# Altium schematic sheet BS01_and_BA01_Connectors.SchDoc
size A4; DocumentNumber: 3; SheetNumber: 3; SheetTotal: 7
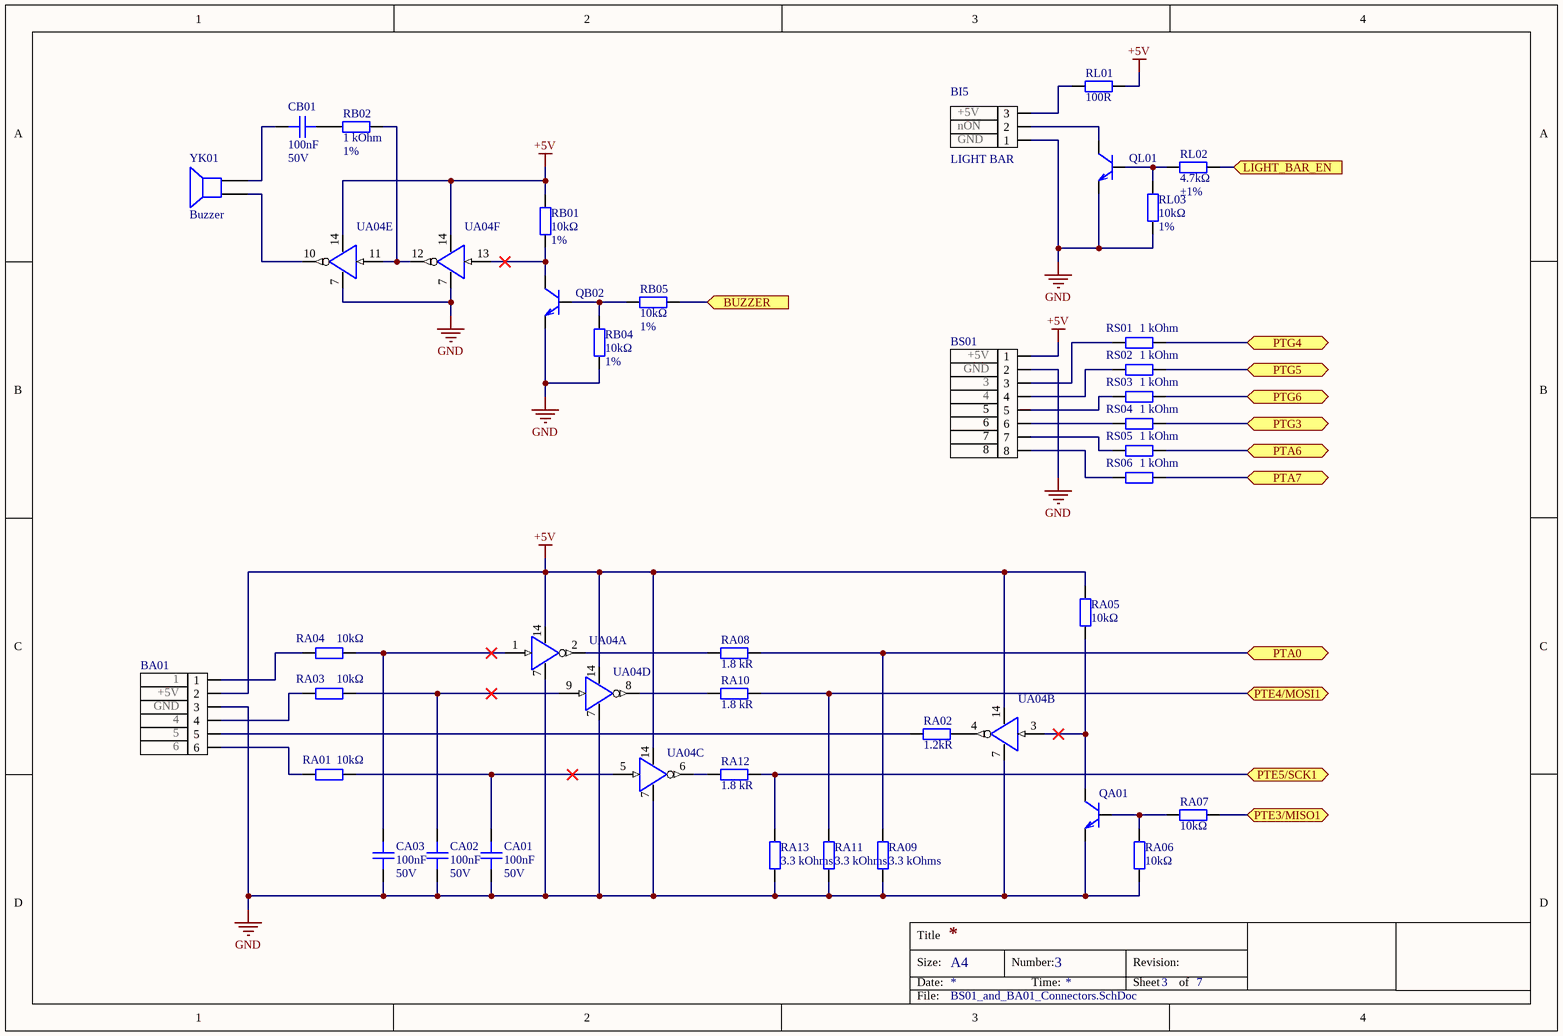
[diagram p0: BS01_and_BA01_Connectors.SchDoc]

## Parts
BA01  pin_1: 1  pin_2: +5V  pin_3: GND  pin_4: 4  pin_5: 5  pin_6: 6  (hidden comment: Comment)
BI5  LIGHT BAR  pin_1: GND  pin_2: nON  pin_3: +5V  [CONN_S3B-ZR_JST]
BS01  pin_1: +5V  pin_2: GND  pin_3: 3  pin_4: 4  pin_7: 7  pin_5: 5  pin_6: 6  pin_8: 8  [CONN HEADER R/A 8POS 2.54MM]  (hidden comment: CONN HEADER R/A 8POS 2.54MM)
CA01  Capacitance: 100nF  Voltage Rating: 50V  [CAPC1608X08N_0603]  (hidden comment: CAP CER 0.1uF ±10% 50V X7R 0603)
CA02  Capacitance: 100nF  Voltage Rating: 50V  [CAPC1608X08N_0603]  (hidden comment: CAP CER 0.1uF ±10% 50V X7R 0603)
CA03  Capacitance: 100nF  Voltage Rating: 50V  [CAPC1608X08N_0603]  (hidden comment: CAP CER 0.1uF ±10% 50V X7R 0603)
CB01  Capacitance: 100nF  Voltage Rating: 50V  [CAPC1608X08N_0603]  (hidden comment: CAP CER 0.1uF ±10% 50V X7R 0603)
QA01  BC847CW,115  [SOT-323]  (value not drawn)
QB02  BC847CW,115  [SOT-323]  (value not drawn)
QL01  BC847CW,115  [SOT-323]  (value not drawn)
RA01  Resistance: 10kΩ  [R0603]  (hidden comment: RES SMD 10K OHM 1% 1/10W 0603)
RA02  Resistance: 1.2kR  [R0402]  (hidden comment: RES SMD 1.2K OHM 1% 1/16W 0402)
RA03  Resistance: 10kΩ  [R0603]  (hidden comment: RES SMD 10K OHM 1% 1/10W 0603)
RA04  Resistance: 10kΩ  [R0603]  (hidden comment: RES SMD 10K OHM 1% 1/10W 0603)
RA05  Resistance: 10kΩ  [R0603]  (hidden comment: RES SMD 10K OHM 1% 1/10W 0603)
RA06  Resistance: 10kΩ  [R0603]  (hidden comment: RES SMD 10K OHM 1% 1/10W 0603)
RA07  Resistance: 10kΩ  [R0603]  (hidden comment: RES SMD 10K OHM 1% 1/10W 0603)
RA08  Resistance: 1.8 kR  [R0402]  (hidden comment: RES SMD 1.91K OHM 1% 1/16W 0402)
RA09  value 3.3 kOhms  [R_0603]  (hidden comment: RES SMD 3.3K OHM 1% 1/4W 0603)
RA10  Resistance: 1.8 kR  [R0402]  (hidden comment: RES SMD 1.91K OHM 1% 1/16W 0402)
RA11  value 3.3 kOhms  [R_0603]  (hidden comment: RES SMD 3.3K OHM 1% 1/4W 0603)
RA12  Resistance: 1.8 kR  [R0402]  (hidden comment: RES SMD 1.91K OHM 1% 1/16W 0402)
RA13  value 3.3 kOhms  [R_0603]  (hidden comment: RES SMD 3.3K OHM 1% 1/4W 0603)
RB01  Resistance: 10kΩ  Tolerance: 1%  [R0603]  (hidden comment: RES SMD 10K OHM 1% 1/10W 0603)
RB02  Resistance: 1 kOhm  Tolerance: 1%  [R0603]  (hidden comment: 1 kOhms ±1% 0.1W, 1/10W Chip Resistor 0603 (1608 Metric) Moisture Resistant Thick Film)  (no BOM)
RB04  Resistance: 10kΩ  Tolerance: 1%  [R0603]  (hidden comment: RES SMD 10K OHM 1% 1/10W 0603)
RB05  Resistance: 10kΩ  Tolerance: 1%  [R0603]  (hidden comment: RES SMD 10K OHM 1% 1/10W 0603)
RL01  Resistance: 100R  [R_0805]
RL02  Resistance: 4.7kΩ  Tolerance: ±1%  [Resistor-0603]
RL03  Resistance: 10kΩ  Tolerance: 1%  [R0603]  (hidden comment: RES SMD 10K OHM 1% 1/10W 0603)
RS01  Resistance: 1 kOhm  [R0603]  (hidden comment: 1 kOhms ±1% 0.1W, 1/10W Chip Resistor 0603 (1608 Metric) Moisture Resistant Thick Film)  (no BOM)
RS02  Resistance: 1 kOhm  [R0603]  (hidden comment: 1 kOhms ±1% 0.1W, 1/10W Chip Resistor 0603 (1608 Metric) Moisture Resistant Thick Film)  (no BOM)
RS03  Resistance: 1 kOhm  [R0603]  (hidden comment: 1 kOhms ±1% 0.1W, 1/10W Chip Resistor 0603 (1608 Metric) Moisture Resistant Thick Film)  (no BOM)
RS04  Resistance: 1 kOhm  [R0603]  (hidden comment: 1 kOhms ±1% 0.1W, 1/10W Chip Resistor 0603 (1608 Metric) Moisture Resistant Thick Film)  (no BOM)
RS05  Resistance: 1 kOhm  [R0603]  (hidden comment: 1 kOhms ±1% 0.1W, 1/10W Chip Resistor 0603 (1608 Metric) Moisture Resistant Thick Film)  (no BOM)
RS06  Resistance: 1 kOhm  [R0603]  (hidden comment: 1 kOhms ±1% 0.1W, 1/10W Chip Resistor 0603 (1608 Metric) Moisture Resistant Thick Film)  (no BOM)
UA04  IC SN74AC14D INVERT SCHMITT 6CH 6IN 14SOIC  (value not drawn)  (parts A,B,C,D,E,F of 6)
YK01  Buzzer  [PIN2]

## Ports
BUZZER (in), LIGHT_BAR_EN (in), PTA0 (bidir), PTA6 (bidir), PTA7 (bidir), PTE3/MISO1 (bidir), PTE4/MOSI1 (bidir), PTE5/SCK1 (bidir), PTG3 (bidir), PTG4 (bidir), PTG5 (bidir), PTG6 (bidir)

## Nets
+5V: BA01.2 BS01.1 RA05.1 RB01.2 RL01.1 UA04.14(VCC)
GND: BA01.3 BI5.1 BS01.2 CA01.1 CA02.1 CA03.1 QA01.2(E) QB02.2(E) QL01.2(E) RA06.2 RA09.2 RA11.2 RA13.2 RB04.1 RL03.1 UA04.7(GND)
BUZZER: RB05.1 ; port BUZZER
LIGHT_BAR_EN: RL02.2 ; port LIGHT_BAR_EN
PTA0: RA08.2 RA09.1 ; port PTA0
PTA6: RS05.2 ; port PTA6
PTA7: RS06.2 ; port PTA7
PTE3/MISO1: RA07.2 ; port PTE3/MISO1
PTE4/MOSI1: RA10.2 RA11.1 ; port PTE4/MOSI1
PTE5/SCK1: RA12.2 RA13.1 ; port PTE5/SCK1
PTG3: RS04.2 ; port PTG3
PTG4: RS01.2 ; port PTG4
PTG5: RS02.2 ; port PTG5
PTG6: RS03.2 ; port PTG6
NetBA01_1: BA01.1 RA04.2
NetBA01_4: BA01.4 RA03.2
NetBA01_5: BA01.5 RA02.1
NetBA01_6: BA01.6 RA01.2
NetBI5_2: BI5.2 QL01.3(C)
NetBI5_3: BI5.3 RL01.2
NetBS01_3: BS01.3 RS01.1
NetBS01_4: BS01.4 RS02.1
NetBS01_5: BS01.5 RS03.1
NetBS01_6: BS01.6 RS04.1
NetBS01_7: BS01.7 RS05.1
NetBS01_8: BS01.8 RS06.1
NetCA01_2: CA01.2 RA01.1 UA04.5(3A)
NetCA02_2: CA02.2 RA03.1 UA04.9(4A)
NetCA03_2: CA03.2 RA04.1 UA04.1(1A)
NetCB01_1: CB01.1 YK01.2
NetCB01_2: CB01.2 RB02.2
NetQA01_1: QA01.1(B) RA06.1 RA07.1
NetQA01_3: QA01.3(C) RA05.2 UA04.3(2A)
NetQB02_1: QB02.1(B) RB04.2 RB05.2
NetQB02_3: QB02.3(C) RB01.1 UA04.13(6A)
NetQL01_1: QL01.1(B) RL02.1 RL03.2
NetRA02_2: RA02.2 UA04.4(2Y)
NetRA08_1: RA08.1 UA04.2(1Y)
NetRA10_1: RA10.1 UA04.8(4Y)
NetRA12_1: RA12.1 UA04.6(3Y)
NetRB02_1: RB02.1 UA04.11(5A) UA04.12(6Y)
NetUA04_10: UA04.10(5Y) YK01.1

## Notes on the sheet
- Title
- Size:
- Date:
- A4
- Number:
- Time:
- Revision:
- Sheet
- of
- File:

## Library data of the parts
BA01 = CONN HEADER EC 6POS
BI5 = CONN HEADER TH R/A 3POS 1.5MM: Connector Header Through Hole, Right Angle 3 position 0.059" (1.50mm); Manufacturer: JST; Manufacturer Part Number: S3B-ZR(LF)(SN); Body Plating: Tin; Current Rating: 1A; Contact Resistance: 30mR; Voltage Rating: 50V; Number of Positions: 3; Gender: Male; Connector Type: Male Pin; Insulation Resistance: 500MR; Pitch: 1.5mm; Panel Thickness: 3.5mm; Supplier 1: Digi-Key; Stock 1: 0; Pricing 1: 1=0.2, 10=0.184, 100=0.1274, 500=0.1078, 1000=0.0882, 5000=0.0784, 10000=0.071 (USD); Mount: Through Hole; Number of Pins: 3; Contact Material: Brass,Copper,Tin; Color: Natural,White; Contact Plating: Tin,Copper; Housing Color: Beige; Housing Material: Polyamide; Material: Nylon; Min Operating Temperature: -25°C; Max Operating Temperature: 85°C; Number of Rows: 1; Packaging: Bulk; Max Current Rating: 1A; Termination: Press-Fit; Fastening Type: Detent; Number of Contacts: 3; Max Voltage Rating (AC): 50V; Orientation: Right Angle; Voltage Rating (AC): 50V; Voltage Rating (DC): 50V; Length: 6mm; Height: 7.2mm; Width: 3.5mm; Depth: 6mm; Lead Pitch: 1.5mm; Contact Mating Length: 0.094inch; Lead Free: Lead Free; REACH SVHC: No SVHC; Flammability Rating: UL94 V-0; ComponentLink1URL: http://www.jst-mfg.com/product/pdf/eng/eZH.pdf?src-supplier=Digi-Key; ComponentLink1Description: http://www.jst-mfg.com/product/pdf/eng/eZH.pdf?src-supplier=Digi-Key; ComponentLink2URL: https://www.verical.com/server-webapp/html/getDatasheet?partID=722697&src-supplier=Verical; ComponentLink2Description: https://www.verical.com/server-webapp/html/getDatasheet?partID=722697&src-supplier=Verical; ComponentLink3URL: http://www.produktinfo.conrad.com/datenblaetter/725000-749999/741155-da-01-en-STIFTLEISTE_GEWINKELT_3_POL_RM1_5.pdf?src-supplier=Conrad; ComponentLink3Description: http://www.produktinfo.conrad.com/datenblaetter/725000-749999/741155-da-01-en-STIFTLEISTE_GEWINKELT_3_POL_RM1_5.pdf?src-supplier=Conrad; Supplier Part Number 1: 455-1670-ND
BS01 = CONN HEADER R/A 8POS 2.54MM: Connector Header Through Hole, Right Angle 8 position 0.100" (2.54mm)
CA01 CA02 CA03 CB01 = CAP CER 0.1uF ±10% 50V X7R 0603: Capacitor; Manufacturer: KEMET; Manufacturer Part Number: C0603C104M5RACTU; Dielectric Material: Ceramic; Tolerance: 20%; Dissipation Factor: 2.5%; Supplier 1: Digi-Key; Stock 1: 1202175; Pricing 1: 1=0.1, 10=0.039, 50=0.0204, 100=0.0174, 500=0.0124, 1000=0.0097 (USD); Mount: Surface Mount,PCB; Case/Package: 0603; Case Code (Metric): 1608; Case Code (Imperial): 0603; Contact Plating: Tin,Matte; Min Operating Temperature: -55°C; Max Operating Temperature: 125°C; Package Quantity: 1; Packaging: Tape and Reel; Voltage Rating (DC): 50V; Dielectric: X7R; Termination: SMD/SMT; Length: 1.6mm; Height: 0.8mm; Width: 0.031inch; Thickness: 0.034inch; Lead Pitch: 0.7mm; Depth: 0.8mm; Radiation Hardening: No; REACH SVHC: No SVHC; ComponentLink1URL: http://www.farnell.com/datasheets/2746056.pdf?src-supplier=Element14; ComponentLink1Description: http://www.farnell.com/datasheets/2746056.pdf?src-supplier=Element14; ComponentLink2URL: http://www.mouser.com/ds/2/212/KEM_C1002_X7R_SMD-1102033.pdf?src-supplier=Mouser; ComponentLink2Description: http://www.mouser.com/ds/2/212/KEM_C1002_X7R_SMD-1102033.pdf?src-supplier=Mouser; ComponentLink3URL: https://www.verical.com/server-webapp/html/getDatasheet?partID=626892&src-supplier=Verical; ComponentLink3Description: https://www.verical.com/server-webapp/html/getDatasheet?partID=626892&src-supplier=Verical; ComponentLink4URL: http://components.arrow.com/part/dataview/40911037S8853915N7429?src-supplier=Arrow; ComponentLink4Description: http://components.arrow.com/part/dataview/40911037S8853915N7429?src-supplier=Arrow; ComponentLink5URL: http://capacitoredge.kemet.com/capedge2/DataSheet?pn=C0603C104M5RAC7867&src-supplier=Avnet; ComponentLink5Description: http://capacitoredge.kemet.com/capedge2/DataSheet?pn=C0603C104M5RAC7867&src-supplier=Avnet; ComponentLink6URL: http://capacitoredge.kemet.com/capedge2/DataSheet?pn=C0603C104M5RAC7867&src-supplier=Avnet+Asia; ComponentLink6Description: http://capacitoredge.kemet.com/capedge2/DataSheet?pn=C0603C104M5RAC7867&src-supplier=Avnet+Asia; ComponentLink7URL: http://www.farnell.com/datasheets/2746056.pdf?src-supplier=Farnell; ComponentLink7Description: http://www.farnell.com/datasheets/2746056.pdf?src-supplier=Farnell; ComponentLink8URL: http://www.farnell.com/datasheets/2746056.pdf?src-supplier=Newark; ComponentLink8Description: http://www.farnell.com/datasheets/2746056.pdf?src-supplier=Newark; ComponentLink9URL: http://www.alliedelec.com/m/d/6f3b5eb83d09db50ed28bdc730567b33.pdf?src-supplier=Allied+Electronics; ComponentLink9Description: http://www.alliedelec.com/m/d/6f3b5eb83d09db50ed28bdc730567b33.pdf?src-supplier=Allied+Electronics; ComponentLink10URL: https://api.kemet.com/component-edge/download/datasheet/C0603C104M5RACTU.pdf?src-supplier=Digi-Key; ComponentLink10Description: https://api.kemet.com/component-edge/download/datasheet/C0603C104M5RACTU.pdf?src-supplier=Digi-Key; ComponentLink11URL: http://www.farnell.com/datasheets/2315113.pdf?src-supplier=Newark; ComponentLink11Description: http://www.farnell.com/datasheets/2315113.pdf?src-supplier=Newark; ComponentLink12URL: http://www.farnell.com/datasheets/1828800.pdf?src-supplier=Newark; ComponentLink12Description: http://www.farnell.com/datasheets/1828800.pdf?src-supplier=Newark; ComponentLink13URL: http://components.arrow.com/part/dataview/0323_00313986?src-supplier=Arrow+Europe; ComponentLink13Description: http://components.arrow.com/part/dataview/0323_00313986?src-supplier=Arrow+Europe; ComponentLink14URL: https://www.verical.com/server-webapp/html/getDatasheet?partID=110138&src-supplier=Verical; ComponentLink14Description: https://www.verical.com/server-webapp/html/getDatasheet?partID=110138&src-supplier=Verical; Supplier Part Number 1: 399-7845-1-ND
QA01 QB02 QL01 = TRANS BC847CW,115 NPN 45V 0.1A SOT323: Bipolar (BJT) Transistor NPN 45V 100mA 100MHz 200mW Surface Mount SOT-323-3; Manufacturer: Nexperia; Supplier 1: Digi-Key; Manufacturer Part Number: BC847CW,115; Stock 1: 327256; Pricing 1: 1=0.13, 10=0.118, 25=0.1124, 100=0.0495, 250=0.0475, 500=0.0389, 1000=0.027 (USD); ComponentLink1URL: http://www.farnell.com/datasheets/1856333.pdf?src-supplier=Farnell; ComponentLink1Description: http://www.farnell.com/datasheets/1856333.pdf?src-supplier=Farnell; ComponentLink2URL: http://www.farnell.com/datasheets/1856333.pdf?src-supplier=Element14; ComponentLink2Description: http://www.farnell.com/datasheets/1856333.pdf?src-supplier=Element14; ComponentLink3URL: https://assets.nexperia.com/documents/data-sheet/BC847_SER.pdf?src-supplier=Digi-Key; ComponentLink3Description: https://assets.nexperia.com/documents/data-sheet/BC847_SER.pdf?src-supplier=Digi-Key; ComponentLink4URL: http://www.farnell.com/datasheets/1856333.pdf?src-supplier=Newark; ComponentLink4Description: http://www.farnell.com/datasheets/1856333.pdf?src-supplier=Newark; Supplier Part Number 1: 1727-4312-1-ND
RA01 RA03 RA04 RA05 RA06 RA07 RB01 RB04 RB05 RL03 = RES SMD 10K OHM 1% 1/10W 0603: 10 kOhms ±1% 0.1W, 1/10W Chip Resistor 0603 (1608 Metric)  Thick Film; Manufacturer: Yageo; Manufacturer Part Number: RC0603FR-0710KL; Temperature Coefficient: 100ppm/°C; Voltage Rating: 75V; Power Rating: 100mW; Voltage Rating (DC): 50V; Supplier 1: Digi-Key; Stock 1: 81498627; Pricing 1: 1=0.1, 10=0.024, 100=0.0097, 1000=0.0044, 2500=0.0038 (USD); Case/Package: 0603; Number of Pins: 2; Weight: 7.1E-05oz; Case Code (Imperial): 0603; Case Code (Metric): 1608; Min Operating Temperature: -55°C; Max Operating Temperature: 155°C; Packaging: Tape and Reel; Composition: Thick Film; Military Standard: Not; Termination: SMD/SMT; Length: 1.6mm; Height: 0.45mm; Width: 0.8mm; Depth: 0.8mm; Lead Pitch: 0.3mm; Lead Free: Lead Free; REACH SVHC: No SVHC; ComponentLink1URL: http://www.farnell.com/datasheets/38590.pdf?src-supplier=Element14; ComponentLink1Description: http://www.farnell.com/datasheets/38590.pdf?src-supplier=Element14; ComponentLink2URL: https://www.verical.com/server-webapp/html/getDatasheet?partID=409289&src-supplier=Verical; ComponentLink2Description: https://www.verical.com/server-webapp/html/getDatasheet?partID=409289&src-supplier=Verical; ComponentLink3URL: http://www.farnell.com/datasheets/1868787.pdf?src-supplier=Element14; ComponentLink3Description: http://www.farnell.com/datasheets/1868787.pdf?src-supplier=Element14; ComponentLink4URL: http://www.farnell.com/datasheets/2167052.pdf?src-supplier=Element14; ComponentLink4Description: http://www.farnell.com/datasheets/2167052.pdf?src-supplier=Element14; ComponentLink5URL: http://www.farnell.com/datasheets/443971.pdf?src-supplier=Element14; ComponentLink5Description: http://www.farnell.com/datasheets/443971.pdf?src-supplier=Element14; Supplier Part Number 1: 311-10.0KHRCT-ND
  RA01 RA03 RA04 RA05 RA06 RA07: Tolerance: 1%
RA02 = RES SMD 1.2K OHM 1% 1/16W 0402: 1.2 kOhms ±1% 0.063W, 1/16W Chip Resistor 0402 (1005 Metric) Moisture Resistant Thick Film; Manufacturer: Yageo; Manufacturer Part Number: RC0402FR-071K2L; Power Rating: 63mW; Voltage Rating: 50V; Temperature Coefficient: 100ppm/°C; Supplier 1: Digi-Key; Stock 1: 894472; Pricing 1: 1=0.1, 10=0.015, 100=0.0062, 1000=0.0028, 2500=0.0024, 5000=0.002 (USD); Case/Package: 0402; Case Code (Imperial): 0402; Case Code (Metric): 1005; Min Operating Temperature: -55°C; Max Operating Temperature: 155°C; Packaging: Tape and Reel; Package Quantity: 1; Termination: SMD/SMT; Composition: Thick Film; Number of Terminations: 2; Military Standard: Not; Max Power Dissipation: 63mW; Features: Moisture Resistant; Length: 1mm; Height: 0.016inch; Width: 0.02inch; Depth: 0.5mm; REACH SVHC: Unknown; Lead Free: Lead Free; ComponentLink1URL: http://www.farnell.com/datasheets/2167052.pdf?src-supplier=Element14; ComponentLink1Description: http://www.farnell.com/datasheets/2167052.pdf?src-supplier=Element14; ComponentLink2URL: https://www.verical.com/server-webapp/html/getDatasheet?partID=323716&src-supplier=Verical; ComponentLink2Description: https://www.verical.com/server-webapp/html/getDatasheet?partID=323716&src-supplier=Verical; ComponentLink3URL: http://documents.rs-components.com/techlib://itc_doclist_GB.htm?stockno=6186138&src-supplier=RSComponents; ComponentLink3Description: http://documents.rs-components.com/techlib://itc_doclist_GB.htm?stockno=6186138&src-supplier=RSComponents; ComponentLink4URL: http://www.yageo.com/documents/recent/PYu-RC_Group_51_RoHS_L_10.pdf?src-supplier=Digi-Key; ComponentLink4Description: http://www.yageo.com/documents/recent/PYu-RC_Group_51_RoHS_L_10.pdf?src-supplier=Digi-Key; ComponentLink5URL: http://www.yageo.com/documents/recent/PYu-RC_Group_51_RoHS_L_9.pdf?src-supplier=Digi-Key; ComponentLink5Description: http://www.yageo.com/documents/recent/PYu-RC_Group_51_RoHS_L_9.pdf?src-supplier=Digi-Key; ComponentLink6URL: http://www.yageo.com/documents/recent/PYu-RC0402_51_RoHS_L_6_r.pdf?src-supplier=Future+Electronics; ComponentLink6Description: http://www.yageo.com/documents/recent/PYu-RC0402_51_RoHS_L_6_r.pdf?src-supplier=Future+Electronics; Supplier Part Number 1: 311-1.20KLRCT-ND; Tolerance: 1%
RA08 RA10 RA12 = RES SMD 1.91K OHM 1% 1/16W 0402: 1.91 kOhms ±1% 0.063W, 1/16W Chip Resistor 0402 (1005 Metric) Moisture Resistant Thick Film; Manufacturer: Yageo; Manufacturer Part Number: RC0402FR-071K91L; Power Rating: 62.5mW; Voltage Rating: 50V; Temperature Coefficient: 100ppm/°C; Max Power Dissipation: 63mW; Supplier 1: Digi-Key; Stock 1: 7277; Pricing 1: 1=0.1, 10=0.015, 100=0.0062, 1000=0.0028, 2500=0.0024, 5000=0.002 (USD); Case/Package: 0402; Case Code (Imperial): 0402; Case Code (Metric): 1005; Contact Plating: Tin,Matte; Min Operating Temperature: -55°C; Max Operating Temperature: 155°C; Packaging: Tape and Reel; Composition: Thick Film; Number of Terminations: 2; Termination: SMD/SMT; Military Standard: Not; Voltage Rating (DC): 50V; Features: Moisture Resistant; Length: 1mm; Height: 0.016inch; Width: 0.02inch; Depth: 0.5mm; Lead Free: Lead Free; ComponentLink1URL: http://www.yageo.com/documents/recent/PYu-RC0402_51_RoHS_L_6.pdf?src-supplier=Avnet+Europe; ComponentLink1Description: http://www.yageo.com/documents/recent/PYu-RC0402_51_RoHS_L_6.pdf?src-supplier=Avnet+Europe; ComponentLink2URL: http://www.yageo.com/documents/recent/PYu-RC0402_51_RoHS_L_6.pdf?src-supplier=Avnet; ComponentLink2Description: http://www.yageo.com/documents/recent/PYu-RC0402_51_RoHS_L_6.pdf?src-supplier=Avnet; Supplier Part Number 1: YAG3049CT-ND; Tolerance: 1%
RA09 RA11 RA13 = RES_SMD_3.3K_OHM_1%_1/4W_0603: PartNumber: CRCW06033K30FKEAHP; Manufacturer: Vishay Dale; Link: https://www.digikey.com/product-detail/en/vishay-dale/CRCW06033K30FKEAHP/541-3.30KSCT-ND/2826016; Digi-KeyPartNumber: 541-3.30KSCT-ND
RB02 = RES SMD 1K OHM 1% 1/10W 0603: Manufacturer: Yageo; Manufacturer Part Number: RC0603FR-071KL; Temperature Coefficient: 100ppm/°C; Voltage Rating: 50V; Power Rating: 100mW; Supplier 1: Digi-Key; Stock 1: 39344753; Pricing 1: 1=0.1, 10=0.023, 100=0.0094, 1000=0.0042, 2500=0.0037 (USD); Case/Package: 0603; Case Code (Imperial): 0603; Case Code (Metric): 1608; Min Operating Temperature: -55°C; Max Operating Temperature: 155°C; Packaging: Tape and Reel; Composition: Thick Film; Military Standard: Not; Termination: SMD/SMT; Length: 1.6mm; Height: 0.45mm; Depth: 0.8mm; Lead Free: Lead Free; REACH SVHC: No SVHC; ComponentLink1URL: http://documents.rs-components.com/techlib://itc_doclist_GB.htm?stockno=5048928&src-supplier=RSComponents; ComponentLink1Description: http://documents.rs-components.com/techlib://itc_doclist_GB.htm?stockno=5048928&src-supplier=RSComponents; ComponentLink2URL: http://www.yageo.com/documents/recent/PYu-RC0603_51_RoHS_L_4.pdf?src-supplier=Avnet+Europe; ComponentLink2Description: http://www.yageo.com/documents/recent/PYu-RC0603_51_RoHS_L_4.pdf?src-supplier=Avnet+Europe; ComponentLink3URL: http://www.farnell.com/datasheets/2167052.pdf?src-supplier=Element14; ComponentLink3Description: http://www.farnell.com/datasheets/2167052.pdf?src-supplier=Element14; ComponentLink4URL: http://www.farnell.com/datasheets/1868787.pdf?src-supplier=Element14; ComponentLink4Description: http://www.farnell.com/datasheets/1868787.pdf?src-supplier=Element14; ComponentLink5URL: http://www.yageo.com/documents/recent/PYu-RC_Group_51_RoHS_L_2.pdf?src-supplier=Avnet; ComponentLink5Description: http://www.yageo.com/documents/recent/PYu-RC_Group_51_RoHS_L_2.pdf?src-supplier=Avnet; Supplier Part Number 1: 311-1.00KHRDKR-ND; Contact Plating: Tin,Matte; Radiation Hardening: No; ComponentLink6URL: https://www.verical.com/server-webapp/html/getDatasheet?partID=404327&src-supplier=Verical; ComponentLink6Description: https://www.verical.com/server-webapp/html/getDatasheet?partID=404327&src-supplier=Verical; ComponentLink7URL: http://www.farnell.com/datasheets/443971.pdf?src-supplier=Element14; ComponentLink7Description: http://www.farnell.com/datasheets/443971.pdf?src-supplier=Element14
RL01 = RES SMD 100 OHM 1% 1/2W 0805: 100 Ohms ±1% 0.5W, 1/2W Chip Resistor 0805 (2012 Metric) Automotive AEC-Q200, Pulse Withstanding Thick Film; Manufacturer: Panasonic; Manufacturer Part Number: ERJ-P6WF1000V; Temperature Coefficient: 200ppm/°C; Power Rating: 500mW; Voltage Rating: 150V; Supplier 1: Digi-Key; Stock 1: 36332; Pricing 1: 1=0.54, 10=0.412, 100=0.1731, 1000=0.0955, 2500=0.0896 (USD); Case/Package: 0805; Case Code (Imperial): 0805; Case Code (Metric): 2012; Min Operating Temperature: -55°C; Max Operating Temperature: 155°C; Packaging: Cut Tape; Composition: Thick Film; Termination: Flat; Number of Terminations: 2; Max Power Dissipation: 500mW; Features: Automotive AEC-Q200; Length: 0.079inch; Height: 0.03inch; Width: 0.049inch; Depth: 1.25mm; Supplier Part Number 1: P16873CT-ND; Tolerance: 1%; Contact Plating: Tin; Voltage Rating (DC): 150V; REACH SVHC: No SVHC; ComponentLink1URL: http://industrial.panasonic.com/www-data/pdf/AOA0000/AOA0000CE4.pdf?src-supplier=Avnet; ComponentLink1Description: http://industrial.panasonic.com/www-data/pdf/AOA0000/AOA0000CE4.pdf?src-supplier=Avnet; ComponentLink2URL: http://www.farnell.com/datasheets/1790600.pdf?src-supplier=Element14; ComponentLink2Description: http://www.farnell.com/datasheets/1790600.pdf?src-supplier=Element14; ComponentLink3URL: https://www.distrelec.biz/Web/Downloads/_t/ds/ERJP-series_eng_tds.pdf?mime=application%2Fpdf&src-supplier=Distrelec; ComponentLink3Description: https://www.distrelec.biz/Web/Downloads/_t/ds/ERJP-series_eng_tds.pdf?mime=application%2Fpdf&src-supplier=Distrelec
RL02 = R 4.7kΩ ±1% 0603 0.1W: Resistor; Manufacturer: Yageo; Manufacturer Part Number: AC0603FR-074K7L; Temperature Coefficient: 100ppm/°C; Power Rating: 100mW; Voltage Rating: 50V; Supplier 1: Digi-Key; Stock 1: 568000; Pricing 1: 1=0.1, 10=0.029, 100=0.0118, 1000=0.0053, 2500=0.0046 (USD); Case/Package: 0603; Case Code (Imperial): 0603; Case Code (Metric): 1608; Min Operating Temperature: -55°C; Max Operating Temperature: 155°C; Packaging: Tape and Reel; Composition: Thick Film; Military Standard: Not; Termination: SMD/SMT; Number of Terminations: 2; Max Power Dissipation: 100mW; Features: Moisture Resistant,Automotive AEC-Q200; Length: 0.063inch; Height: 0.022inch; Width: 0.031inch; Depth: 0.8mm; Lead Free: Lead Free; Supplier Part Number 1: YAG3613CT-ND
RS01 RS02 RS03 RS04 RS05 RS06 = RES SMD 1K OHM 1% 1/10W 0603: Manufacturer: Yageo; Manufacturer Part Number: RC0603FR-071KL; Temperature Coefficient: 100ppm/°C; Power Rating: 100mW; Voltage Rating: 50V; Supplier 1: Digi-Key; Stock 1: 39344753; Pricing 1: 1=0.1, 10=0.023, 100=0.0094, 1000=0.0042, 2500=0.0037 (USD); Contact Plating: Tin,Matte; Case Code (Imperial): 0603; Case Code (Metric): 1608; Min Operating Temperature: -55°C; Max Operating Temperature: 155°C; Composition: Thick Film; Packaging: Tape and Reel; Termination: SMD/SMT; Military Standard: Not; Length: 1.6mm; Height: 0.45mm; Depth: 0.8mm; Radiation Hardening: No; REACH SVHC: No SVHC; Lead Free: Lead Free; ComponentLink1URL: http://documents.rs-components.com/techlib://itc_doclist_GB.htm?stockno=5048928&src-supplier=RSComponents; ComponentLink1Description: http://documents.rs-components.com/techlib://itc_doclist_GB.htm?stockno=5048928&src-supplier=RSComponents; ComponentLink2URL: http://www.yageo.com/documents/recent/PYu-RC0603_51_RoHS_L_4.pdf?src-supplier=Avnet+Europe; ComponentLink2Description: http://www.yageo.com/documents/recent/PYu-RC0603_51_RoHS_L_4.pdf?src-supplier=Avnet+Europe; ComponentLink3URL: http://www.farnell.com/datasheets/2167052.pdf?src-supplier=Element14; ComponentLink3Description: http://www.farnell.com/datasheets/2167052.pdf?src-supplier=Element14; ComponentLink4URL: http://www.farnell.com/datasheets/1868787.pdf?src-supplier=Element14; ComponentLink4Description: http://www.farnell.com/datasheets/1868787.pdf?src-supplier=Element14; ComponentLink5URL: http://www.yageo.com/documents/recent/PYu-RC_Group_51_RoHS_L_2.pdf?src-supplier=Avnet; ComponentLink5Description: http://www.yageo.com/documents/recent/PYu-RC_Group_51_RoHS_L_2.pdf?src-supplier=Avnet; ComponentLink6URL: https://www.verical.com/server-webapp/html/getDatasheet?partID=404327&src-supplier=Verical; ComponentLink6Description: https://www.verical.com/server-webapp/html/getDatasheet?partID=404327&src-supplier=Verical; ComponentLink7URL: http://www.farnell.com/datasheets/443971.pdf?src-supplier=Element14; ComponentLink7Description: http://www.farnell.com/datasheets/443971.pdf?src-supplier=Element14; Supplier Part Number 1: 311-1.00KHRDKR-ND; Case/Package: 0603; Tolerance: 1%
UA04 = IC SN74AC14D INVERT SCHMITT 6CH 6IN 14SOIC: Inverter IC 6 Channel Schmitt Trigger 14-SOIC; Manufacturer: ON Semiconductor / Fairchild; Manufacturer Part Number: 74AC14SCX; Logic Function: Buffer,Inverter,Schmitt Trigger; Number of Elements: 6; Propagation Delay: 15ns; Max Supply Voltage: 6V; Min Supply Voltage: 2V; Number of Inputs: 1; Quiescent Current: 2uA; High Level Output Current: -24mA; Low Level Output Current: 24mA; Schmitt Trigger Input: Yes; Voltage: 5V; Supplier 1: Digi-Key; Stock 1: 0; Pricing 1: 1=0.74, 10=0.649, 25=0.6092, 100=0.4972, 250=0.4618, 500=0.393, 1000=0.3245 (USD); Mount: Surface Mount; Case/Package: SOIC; Number of Pins: 14; Weight: 0.008501oz; Contact Plating: Tin,Matte; Min Operating Temperature: -40°C; Max Operating Temperature: 85°C; Packaging: Tape and Reel; Package Quantity: 2500; Number of Circuits: 6; Turn-On Delay Time: 15ns; Output Current: 24mA; Number of Gates: 6; Series: 74AC; Input Type: SCHMITT TRIGGER; Technology: CMOS; Number of Functions: 6; Supply Voltage-Nom: 6V; Length: 8.75mm; Width: 4mm; Height: 1.5mm; Radiation Hardening: No; Lead Free: Lead Free; RoHS Compliant: Yes; REACH SVHC: No SVHC; ComponentLink1URL: http://www.jameco.com/Jameco/Products/ProdDS/1203344.pdf?src-supplier=Jameco; ComponentLink1Description: http://www.jameco.com/Jameco/Products/ProdDS/1203344.pdf?src-supplier=Jameco; ComponentLink2URL: http://www.farnell.com/datasheets/1573464.pdf?src-supplier=Element14; ComponentLink2Description: http://www.farnell.com/datasheets/1573464.pdf?src-supplier=Element14; ComponentLink3URL: https://www.fairchildsemi.com/datasheets/74/74AC14.pdf?src-supplier=Avnet; ComponentLink3Description: https://www.fairchildsemi.com/datasheets/74/74AC14.pdf?src-supplier=Avnet; ComponentLink4URL: http://www.fairchildsemi.com/ds/74/74AC14.pdf?src-supplier=Future+Electronics; ComponentLink4Description: http://www.fairchildsemi.com/ds/74/74AC14.pdf?src-supplier=Future+Electronics; ComponentLink5URL: https://www.verical.com/server-webapp/html/getDatasheet?partID=83187&src-supplier=Verical; ComponentLink5Description: https://www.verical.com/server-webapp/html/getDatasheet?partID=83187&src-supplier=Verical; ComponentLink6URL: http://www.fairchildsemi.com/ds/74/74AC14.pdf?src-supplier=Avnet; ComponentLink6Description: http://www.fairchildsemi.com/ds/74/74AC14.pdf?src-supplier=Avnet; ComponentLink7URL: https://www.fairchildsemi.com/datasheets/74/74AC14.pdf?src-supplier=Digi-Key; ComponentLink7Description: https://www.fairchildsemi.com/datasheets/74/74AC14.pdf?src-supplier=Digi-Key; ComponentLink8URL: http://www.fairchildsemi.com/datasheets/74/74AC14.pdf?src-supplier=Digi-Key; ComponentLink8Description: http://www.fairchildsemi.com/datasheets/74/74AC14.pdf?src-supplier=Digi-Key; ComponentLink9URL: https://www.onsemi.com/pub/Collateral/74ACT14-D.pdf?src-supplier=Digi-Key; ComponentLink9Description: https://www.onsemi.com/pub/Collateral/74ACT14-D.pdf?src-supplier=Digi-Key; Supplier Part Number 1: 74AC14SCXDKR-ND
YK01 = Speaker: Loudspeaker; Published: 24-Mar-1999; LatestRevisionDate: 17-Jul-2002; LatestRevisionNote: Re-released for DXP Platform.; PackageReference: PIN2; Publisher: Altium Limited